# Altium schematic sheet PiTopUSBHub.SchDoc: Main USB Hub
size A4; Author: Sorgelig; Revision: 2.0; SheetNumber: 1; SheetTotal: 2
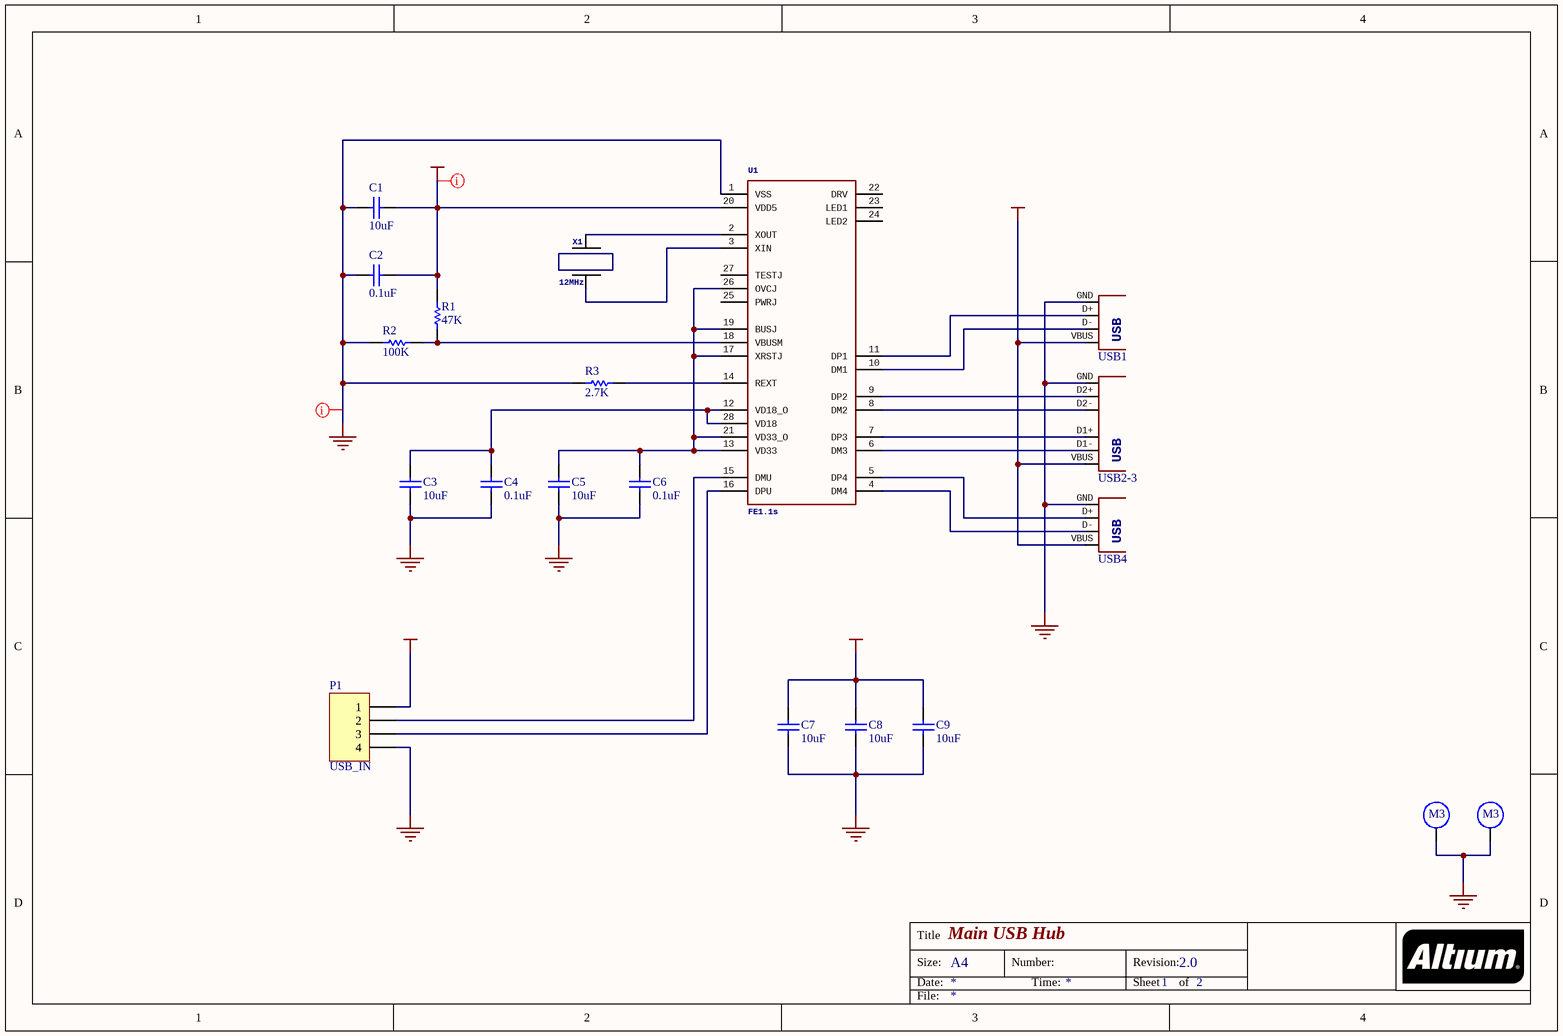
[diagram p0: PiTopUSBHub.SchDoc]

## Parts
C1  value 10uF  [C0805]  (hidden comment: C0805)
C2  value 0.1uF  [C0805]  (hidden comment: C0805)
C3  value 10uF  [C0805]  (hidden comment: C0805)
C4  value 0.1uF  [C0805]  (hidden comment: C0805)
C5  value 10uF  [C0805]  (hidden comment: C0805)
C6  value 0.1uF  [C0805]  (hidden comment: C0805)
C7  value 10uF  [C0805]  (hidden comment: C0805)
C8  value 10uF  [C0805]  (hidden comment: C0805)
C9  value 10uF  [C0805]  (hidden comment: C0805)
H1  M3  [M3]  (value not drawn)
H2  M3  [M3]  (value not drawn)
P1  USB_IN  [HDR1X4]
R1  47K  [R0805]
R2  100K  [R0805]
R3  2.7K  [R0805]
U1  FE1.1S  [FE1.1S_SSOP-28]
USB1  USBA-PTH  [USB-A-F-PTH]  (value not drawn)
USB2-3  USBA2x-PTH  [USB-A-2x-F-PTH]  (value not drawn)
USB4  USBA-PTH  [USB-A-F-PTH]  (value not drawn)
X1  12MHz  [XTAL_G5032]

## Nets
GND: C1.2 C2.2 C3.2 C4.2 C5.2 C6.2 C7.2 C8.2 C9.2 H1.1 H2.1 P1.4 R2.2 R3.1 U1.1(VSS) USB1.GND USB2-3.GND USB4.GND
VCC: C1.1 C2.1 C7.1 C8.1 C9.1 P1.1 R1.1 U1.20(VDD5) USB1.VBUS USB2-3.VBUS USB4.VBUS
NetC3_1: C3.1 C4.1 U1.12(VD18_O) U1.28(VD18)
NetC5_1: C5.1 C6.1 U1.13(VD33) U1.17(XRSTJ) U1.19(BUSJ) U1.21(VD33_O) U1.26(OVCJ)
NetP1_2: P1.2 U1.15(DMU)
NetP1_3: P1.3 U1.16(DPU)
NetR1_2: R1.2 R2.1 U1.18(VBUSM)
NetR3_2: R3.2 U1.14(REXT)
NetU1_2: U1.2(XOUT) X1.2
NetU1_3: U1.3(XIN) X1.1
NetU1_4: U1.4(DM4) USB4.D-
NetU1_5: U1.5(DP4) USB4.D+
NetU1_6: U1.6(DM3) USB2-3.D1-
NetU1_7: U1.7(DP3) USB2-3.D1+
NetU1_8: U1.8(DM2) USB2-3.D2-
NetU1_9: U1.9(DP2) USB2-3.D2+
NetU1_10: U1.10(DM1) USB1.D-
NetU1_11: U1.11(DP1) USB1.D+

Not connected (* = marked no-connect by the designer): U1 22(DRV) 23(LED1) 24(LED2) 25(PWRJ) 27(TESTJ)

## Layout directives
net class power: GND, VCC

## Notes on the sheet
- Title
- Size:
- Date:
- A4
- Number:
- Time:
- Revision:
- Sheet
- of
- File:

## Library data of the parts
C1-C9 = C0805: Ceramic Chip Capacitor - Standard; Note: Footprint corresponds to dimensions for bulk cassette packaging. This case size has tightened tolerances.; Published: 17-Jul-2002; LatestRevisionDate: 19-Mar-2004; LatestRevisionNote: Silkscreen size reduced.; DatasheetDocument: Mar-2001; PackageDocument: Mar-2001; PackageReference: 0805; Publisher: Altium Limited; Code_JEITA: 0805; Code_IPC: 2012[0805]; ComponentLink1Description: Manufacturer Link; ComponentLink1URL: http://www.kemet.com/; ComponentLink2Description: Datasheet; ComponentLink2URL: http://www.kemet.com/kemet/web/homepage/kechome.nsf/vapubfilesname/F3102TA.pdf/$file/F3102TA.pdf
P1 = Header 4: Header, 4-Pin; LatestRevisionDate: 17-Jul-2002; LatestRevisionNote: Re-released for DXP Platform.; Publisher: Altium Limited
R1-R3 = ERJ6RS: Low Ohmic Value Thick Film Chip Resistor, 0.1 Ohm to 0.2 Ohm Range, 1%, 2% and 5% Tolerance, 0805 Size, 0.125 W; Published: 17-Dec-2003; LatestRevisionDate: 19-Mar-2004; LatestRevisionNote: Silkscreen size reduced.; PackageDocument: Mar-2003; PackageReference: 6-0805; Publisher: Altium Limited; Code_IPC: 2012 [0805]; ComponentLink1Description: Manufacturer Link; ComponentLink1URL: http://www.panasonic.com/industrial/components/resistive_products.htm; ComponentLink2Description: Datasheet; ComponentLink2URL: http://www.panasonic.com/industrial/components/pdf/AOA0000CE3.pdf
X1 = CRYSTALHC49UP: PTH: ...   SMD: ...   Cylinder: CMR200T-32.768KDZBT
U1 = FE1.1S: FE1.1s: FE1.1s
USB1 USB4 = USBA-PTH: USB: USB
USB2-3 = USBA2x-PTH: USB: USB